# Altium schematic sheet rgbController.SchDoc
size A
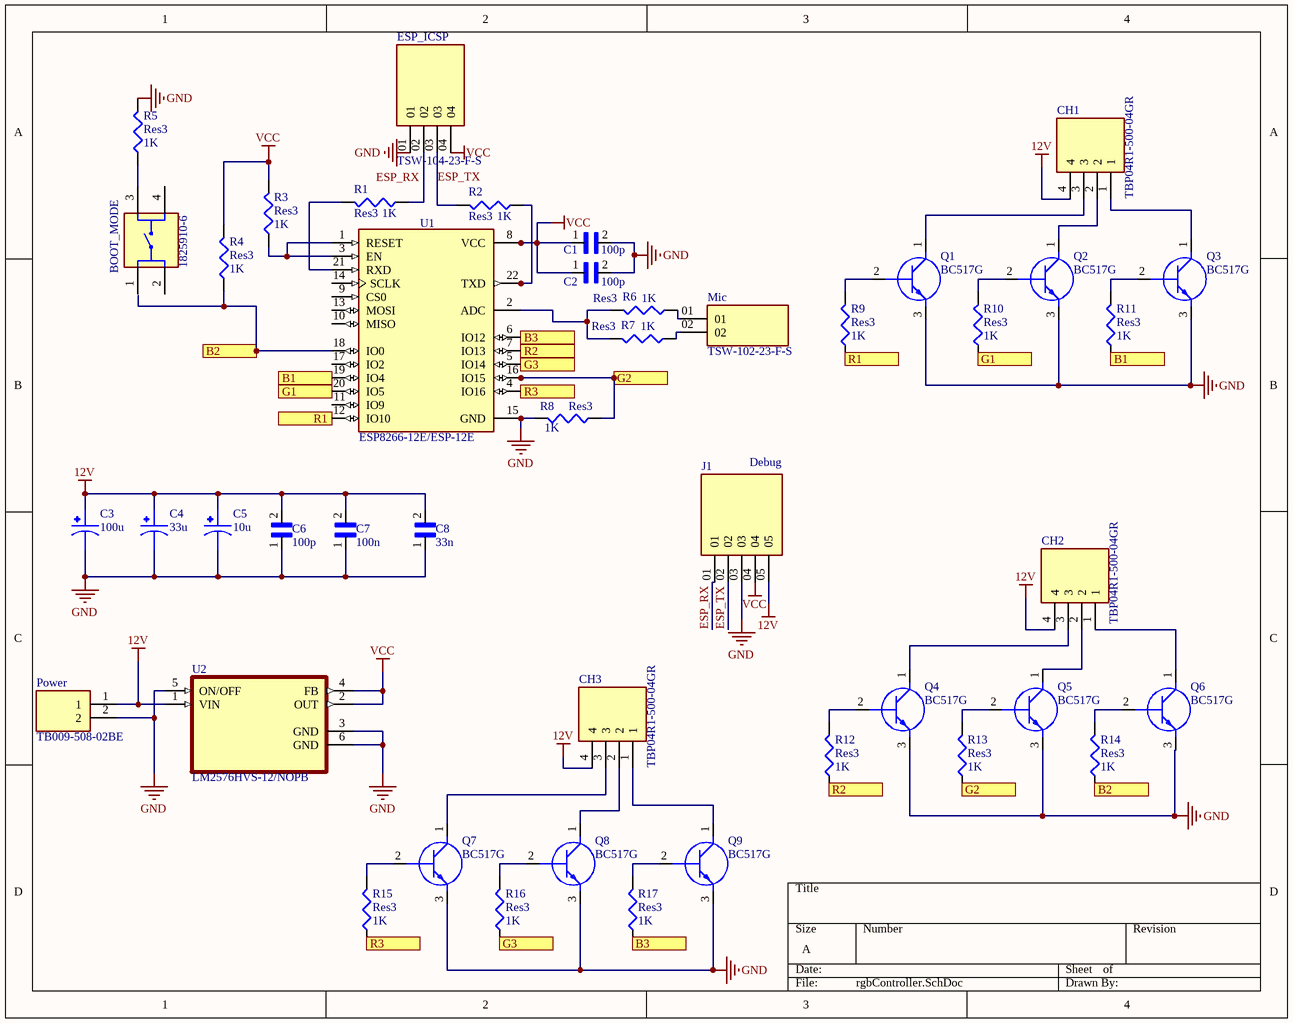
[diagram p0: rgbController.SchDoc]

## Parts
BOOT_MODE  1825910-6  [SW_1825910-6-4]
C1  100p  [CAP_RCE5C1H101J0DBH03A]
C2  100p  [CAP_RCE5C1H101J0DBH03A]
C3  100u  [CAPPRD250W60D630H900]
C4  33u  [CAPPRD250W60D630H900]
C5  10u  [CAPPRD250W60D630H900]
C6  100p  [CAP_RCE5C1H101J0DBH03A]
C7  100n  [CAP_RCE5C1H101J0DBH03A]
C8  33n  [CAP_RCE5C1H101J0DBH03A]
CH1  TBP04R1-500-04GR  [CUI_TBP04R1-500-04GR]
CH2  TBP04R1-500-04GR  [CUI_TBP04R1-500-04GR]
CH3  TBP04R1-500-04GR  [CUI_TBP04R1-500-04GR]
ESP_ICSP  TSW-104-23-F-S  [SAMTEC_TSW-104-23-F-S]
J1  Debug  [SAMTEC_TSW-105-23-F-S]
Mic  TSW-102-23-F-S  [SAMTEC_TSW-102-23-F-S]
Power  TB009-508-02BE  [CUI_TB009-508-02BE]
Q1  BC517G  [TO-92_(TO-226)]
Q2  BC517G  [TO-92_(TO-226)]
Q3  BC517G  [TO-92_(TO-226)]
Q4  BC517G  [TO-92_(TO-226)]
Q5  BC517G  [TO-92_(TO-226)]
Q6  BC517G  [TO-92_(TO-226)]
Q7  BC517G  [TO-92_(TO-226)]
Q8  BC517G  [TO-92_(TO-226)]
Q9  BC517G  [TO-92_(TO-226)]
R1  Res3  value 1K  [J1-0603]
R2  Res3  value 1K  [J1-0603]
R3  Res3  value 1K  [J1-0603]
R4  Res3  value 1K  [J1-0603]
R5  Res3  value 1K  [J1-0603]
R6  Res3  value 1K  [J1-0603]
R7  Res3  value 1K  [J1-0603]
R8  Res3  value 1K  [J1-0603]
R9  Res3  value 1K  [J1-0603]
R10  Res3  value 1K  [J1-0603]
R11  Res3  value 1K  [J1-0603]
R12  Res3  value 1K  [J1-0603]
R13  Res3  value 1K  [J1-0603]
R14  Res3  value 1K  [J1-0603]
R15  Res3  value 1K  [J1-0603]
R16  Res3  value 1K  [J1-0603]
R17  Res3  value 1K  [J1-0603]
U1  ESP8266-12E/ESP-12E  [XCVR_ESP8266-12E/ESP-12E]
U2  LM2576HVS-12/NOPB  [VREG_TPS79625KTTR]

## Ports
B1, B2, B3, G1, G2, G3, R1, R2, R3

## Nets
12V: C3.1 C4.1 C5.1 C6.2 C7.2 C8.2 CH1.4 CH2.4 CH3.4 J1.05 Power.1 U2.1(VIN)
GND: C1.2 C2.2 C3.2 C4.2 C5.2 C6.1 C7.1 C8.1 ESP_ICSP.01 J1.03 Power.2 Q1.3(E) Q2.3(E) Q3.3(E) Q4.3(E) Q5.3(E) Q6.3(E) Q7.3(E) Q8.3(E) Q9.3(E) R5.2 R8.2 U1.15(GND) U2.3(GND) U2.5(ON/OFF) U2.6(GND)
VCC: C1.1 C2.1 ESP_ICSP.04 J1.04 R3.2 R4.2 U1.8(VCC) U2.2(OUT) U2.4(FB)
B1: R11.1 U1.19(IO4) ; port B1
B2: R4.1 R14.1 U1.18(IO0) ; port B2
B3: R17.1 U1.6(IO12) ; port B3
ESP_RX: J1.01
ESP_TX: ESP_ICSP.03 J1.02 R2.2
G1: R10.1 U1.20(IO5) ; port G1
G2: R8.1 R13.1 U1.16(IO15) ; port G2
G3: R16.1 U1.5(IO14) ; port G3
R1: R9.1 U1.12(IO10) ; port R1
R2: R12.1 U1.7(IO13) ; port R2
R3: R15.1 U1.4(IO16) ; port R3
NetBOOT_MODE_3: BOOT_MODE.3 R5.1
NetCH1_1: CH1.1 Q3.1(C)
NetCH1_2: CH1.2 Q2.1(C)
NetCH1_3: CH1.3 Q1.1(C)
NetCH2_1: CH2.1 Q6.1(C)
NetCH2_2: CH2.2 Q5.1(C)
NetCH2_3: CH2.3 Q4.1(C)
NetCH3_1: CH3.1 Q9.1(C)
NetCH3_2: CH3.2 Q8.1(C)
NetCH3_3: CH3.3 Q7.1(C)
NetESP_ICSP_02: ESP_ICSP.02 R1.1
NetMic_01: Mic.01 R6.1
NetMic_02: Mic.02 R7.1
NetQ1_2: Q1.2(B) R9.2
NetQ2_2: Q2.2(B) R10.2
NetQ3_2: Q3.2(B) R11.2
NetQ4_2: Q4.2(B) R12.2
NetQ5_2: Q5.2(B) R13.2
NetQ6_2: Q6.2(B) R14.2
NetQ7_2: Q7.2(B) R15.2
NetQ8_2: Q8.2(B) R16.2
NetQ9_2: Q9.2(B) R17.2
NetR1_2: R1.2 U1.21(RXD)
NetR2_1: R2.1 U1.22(TXD)
NetR3_1: R3.1 U1.1(RESET) U1.3(EN)
NetR6_2: R6.2 R7.2 U1.2(ADC)

Not connected (* = marked no-connect by the designer): BOOT_MODE 1 2 4; U1 9(CS0) 10(MISO) 11(IO9) 13(MOSI) 14(SCLK) 17(IO2)

## Notes on the sheet
- Labels drawn without touching a wire or pin: ESP_RX

## Library data of the parts
BOOT_MODE = 1825910-6: Switch Push Button OFF (ON) SPST Round Button 0.05A 24VDC Momentary Contact PC Pins Thru-Hole; MF: TE Connectivity; Value: *; MP: 1825910-6; Package: None; Check_prices: https://www.snapeda.com/parts/1825910-6/TE+Connectivity+ALCOSWITCH+Switches/view-part/?ref=eda; SnapEDA_Link: https://www.snapeda.com/parts/1825910-6/TE+Connectivity+ALCOSWITCH+Switches/view-part/?ref=snap; Digi-Key_Part_Number: 450-1650-ND; Purchase-URL: https://pricing.snapeda.com/search/part/1825910-6/?ref=eda
C1 C2 C6-C8 = RCE5C1H101J0DBH03A: Lead Capacitor C0G(EIA) with Capacitance: 100pF and Rated Voltage: 50Vdc; MF: Murata; Availability: Unavailable; Price: None; SnapEDA_Link: https://www.snapeda.com/parts/RCE5C1H101J0DBH03A/Murata/view-part/4545991/?ref=snap; Value: *; MP: RCE5C1H101J0DBH03A; Package: Radial Murata
C3-C5 = 16SEPC100MW+C3: Conductive Polymer Aluminum Solid Capacitors, SEPC Series, 100uF , -55 +105C, 16V, radial lead type (6.3 x 9mm); MF: Panasonic; SnapEDA_Link: https://www.snapeda.com/parts/16SEPC100MW+C3/Panasonic/view-part/?ref=snap; Price: None; MP: 16SEPC100MW+C3; Package: RADIAL-2 Panasonic; Value: *; Check_prices: https://www.snapeda.com/parts/16SEPC100MW+C3/Panasonic/view-part/?ref=eda; Availability: Not in stock
CH1-CH3 = TBP04R1-500-04GR: Terminal Block; Value: *; MP: TBP04R1-500-04GR; Package: None; Availability: Unavailable; Price: None
ESP_ICSP = TSW-104-23-F-S: Connector Header Through Hole 4 position 0.100 (2.54mm); MF: Samtec; SnapEDA_Link: https://www.snapeda.com/parts/TSW-104-23-F-S/Samtec/view-part/?ref=snap; Package: None; MP: TSW-104-23-F-S; Check_prices: https://www.snapeda.com/parts/TSW-104-23-F-S/Samtec/view-part/?ref=eda; Purchase-URL: https://pricing.snapeda.com/search/part/TSW-104-23-F-S/?ref=eda; Price: None; Value: *; Availability: In Stock
J1 = TSW-105-23-F-S: Connector Header Through Hole 5 position 0.100 (2.54mm); MF: Samtec; SnapEDA_Link: https://www.snapeda.com/parts/TSW-105-23-F-S/Samtec/view-part/?ref=snap; MP: TSW-105-23-F-S; Digi-Key_Part_Number: TSW-105-23-F-S-ND; Purchase-URL: https://pricing.snapeda.com/search/part/TSW-105-23-F-S/?ref=eda; Value: *; Package: None; Check_prices: https://www.snapeda.com/parts/TSW-105-23-F-S/Samtec/view-part/?ref=eda
Power = TB009-508-02BE: 2~24 Poles, Screw Type, Horizontal, 5.08 Pitch, 26~12 (AWG), Terminal Block Connector; MF: CUI Devices; SnapEDA_Link: https://www.snapeda.com/parts/TB009-508-02BE/CUI+Devices/view-part/?ref=snap; Check_prices: https://www.snapeda.com/parts/TB009-508-02BE/CUI+Devices/view-part/?ref=eda; Value: *; Availability: In Stock; CUI_purchase_URL: https://www.cuidevices.com/product/interconnect/connectors/terminal-blocks/tb009-508-series?utm_source=snapeda.com&utm_medium=referral&utm_campaign=snapedaBOM; Price: None; MP: TB009-508-02BE; Package: None; Purchase-URL: https://pricing.snapeda.com/search/part/TB009-508-02BE/?ref=eda
Q1-Q9 = BC517G: Transistor BJT NPN; Manufacturer_Name: onsemi; Datasheet Link: https://datasheet.datasheetarchive.com/originals/distributors/Datasheets-24/DSA-461072.pdf; Manufacturer_Part_Number: BC517G; Mouser Part Number: 863-BC517G; Mouser Price/Stock: https://www.mouser.com/Search/Refine.aspx?Keyword=863-BC517G
R1-R17 = Res3: Resistor; Published: 8-Jun-2000; LatestRevisionDate: 29-May-2009; LatestRevisionNote: IPC-7351 Footprint Added.; PackageReference: J1-0603; Publisher: Altium Limited; PackageDescription: Chip Resistor
U1 = ESP8266-12E/ESP-12E: This WiFi module has a 32-bit MCU micro and clock speeds supporting 80 MHz or 160 MHz. Supports the RTOS and integrated Wi-Fi MAC/BB/RF/PA/LNA, and has an on-board antenna.; MF: AI-Thinker; Value: *; SnapEDA_Link: https://www.snapeda.com/parts/ESP8266-12E/ESP-12E/AI-Thinker/view-part/?ref=snap; Availability: Not in stock; Price: None; Package: None; Check_prices: https://www.snapeda.com/parts/ESP8266-12E/ESP-12E/AI-Thinker/view-part/?ref=eda; MP: ESP8266-12E/ESP-12E
U2 = LM2576HVS-12/NOPB: SIMPLE SWITCHER&reg; 4V to 60V, 3A Low Component Count Step-Down Regulator 5-DDPAK/TO-263 -40 to 125; MF: Texas Instruments; SnapEDA_Link: https://www.snapeda.com/parts/LM2576HVS-12/Texas+Instruments/view-part/?ref=snap; Package: TO-263-5 Texas Instruments; MP: LM2576HVS-12; Check_prices: https://www.snapeda.com/parts/LM2576HVS-12/Texas+Instruments/view-part/?ref=eda; Purchase-URL: https://pricing.snapeda.com/search/part/LM2576HVS-12/?ref=eda; Price: None; Value: *; Availability: In Stock
Mic = TSW-102-23-F-S: Price: None; MP: TSW-102-23-F-S; Package: None; Availability: Unavailable; Value: *